# Altium project Current Transducer.PrjPCB
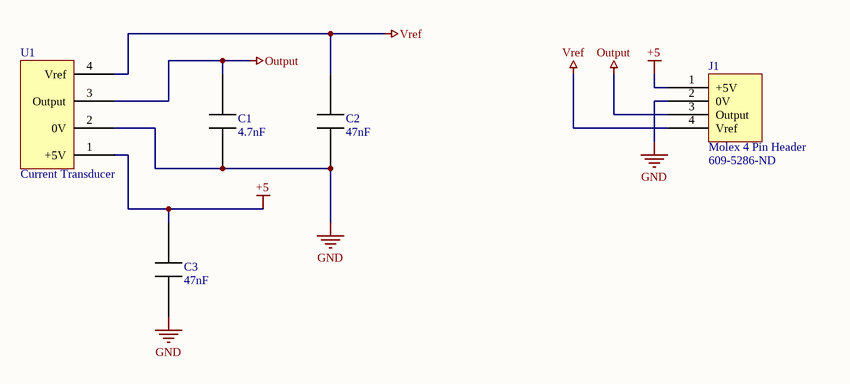
[diagram p0: Current Transducer.SchDoc]
1 sheet, 5 parts. Net scope: global (net labels, ports and power ports of the same name join across sheets).
Board file: Current Transducer PCB.PcbDoc

## Sheet Current Transducer.SchDoc
size A

### Parts
C1  4.7nF  [CAPC2012X10N]
C2  47nF  [CAPC2012X10N]
C3  47nF  [CAPC2012X10N]
J1  Molex 4 Pin Header  Supplier Part Number 1: 609-5286-ND  [4 Pin Header]
U1  Current Transducer  [Current Transducer]

### Nets
+5: C3.2 J1.1(+5V) U1.1(+5V)
GND: C1.1 C2.1 C3.1 J1.2(0V) U1.2(0V)
Output: C1.2 J1.3(Output) U1.3(Output)
Vref: C2.2 J1.4(Vref) U1.4(Vref)

### Library data of the parts
C1-C3 = 47nF capacitor: Supplier 1: Digi-Key; Supplier Part Number 1: 490-3254-6-ND
J1 = Molex 4 Pin Header: Supplier 1: Digi-Key
U1 = Current Transducer: Supplier 1: Newark; Supplier Part Number 1: 52K4609